# EAGLE schematic Layout Rev5 (EAGLE 9.5.1)
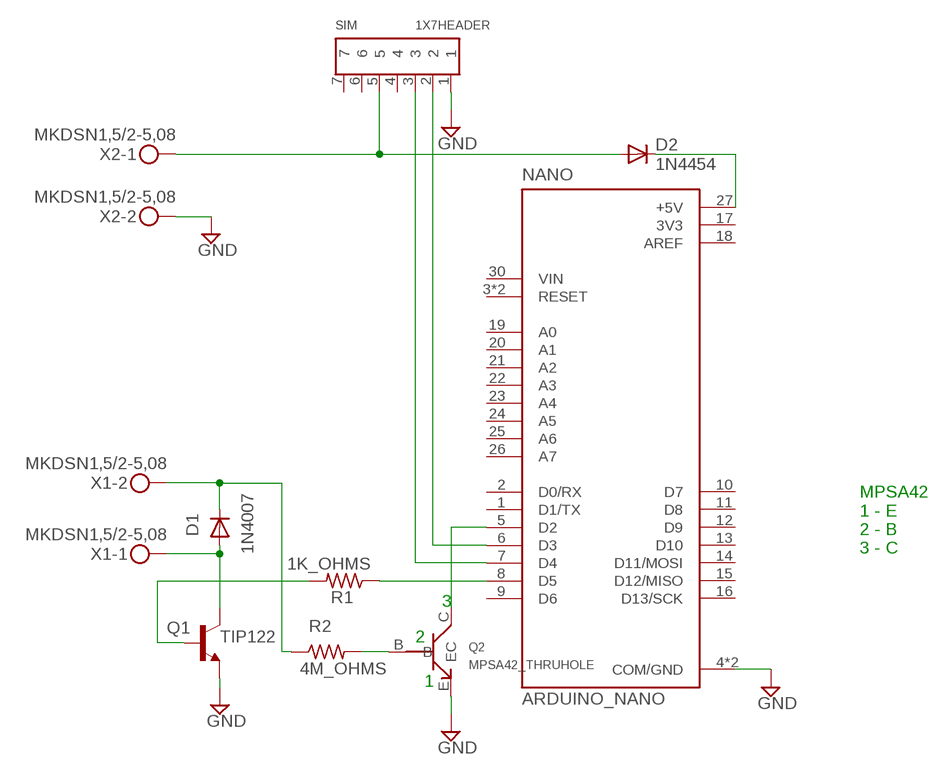
[diagram p0: schematic, sheet 1]

## Parts
D1  1N4007  1N4004  [DO41-10]
D2  1N4454  1N4004  [DO41-10]
NANO  ARDUINO_NANO  [SHIELD_ARDUINO_NANO]
Q1  TIP122  2SC1306  [TO220BV]
Q2  MPSA42_THRUHOLE  [MPSA42]
R1  1K_OHMS  R-US_0207/10  [0207/10]
R2  4M_OHMS  R-US_0207/10  [0207/10]
SIM  1X7HEADER  [1X7HEADER]
X1  MKDSN1,5/2-5,08  [MKDSN1,5/2-5,08]
X2  MKDSN1,5/2-5,08  [MKDSN1,5/2-5,08]

## Nets
+5V [power]: D2.A SIM.5 X2.1
GND: NANO.4(COM/GND) NANO.29(COM/GND) Q1.3(E) Q2.E SIM.1 X2.2
N$1: NANO.7(D4) SIM.3
N$2: NANO.6(D3) SIM.2
N$3 [power]: D1.C R2.1 X1.2
N$4: NANO.8(D5) R1.1
N$5 [power]: D1.A Q1.2(C) X1.1
N$7: Q2.B R2.2
N$10 [power]: D2.C NANO.27(+5V)
N$15: NANO.5(D2) Q2.C
N$16: Q1.1(B) R1.2
Unconnected: NANO.1(D1/TX) NANO.2(D0/RX) NANO.3(RESET) NANO.9(D6) NANO.10(D7) NANO.11(D8) NANO.12(D9) NANO.13(D10) NANO.14(D11/MOSI) NANO.15(D12/MISO) NANO.16(D13/SCK) NANO.19(A0) NANO.20(A1) NANO.21(A2) NANO.22(A3) NANO.23(A4) NANO.24(A5) NANO.25(A6) NANO.26(A7) NANO.28(RESET) NANO.30(VIN) SIM.4 SIM.6 SIM.7

## Notes on the sheet
- MPSA42
  1 - E
  2 - B
  3 - C
- 3
- 2
- 1

## Power pins joined to a net without a drawn wire
3V3: NANO.17(3V3)
AREF: NANO.18(AREF)

## Library data of the parts
D1 D2 = diode:1N4004: DIODE general purpose rectifier, 1 A
NANO = ARDUINO_NANO:ARDUINO_NANO: Arduino Nano, Through Hole; AVAILABILITY: Unavailable; DESCRIPTION: Dev.kit: Arduino; UART; ICSP, USB B mini, pin strips; MF: Arduino; MP: ARDUINO NANO; PACKAGE: None; PRICE: None
Q1 = transistor:2SC1306: NPN Transistor Final RF Power Outupt Source: 2sc1306.pdf
Q2 = MPSA42_thruhole:MPSA42_THRUHOLE
R1 R2 = rcl:R-US_: RESISTOR, American symbol; SPICEPREFIX: R
SIM = 1x7header:1X7HEADER
X1 X2 = con-phoenix-508:MKDSN1,5/2-5,08: MKDSN 1,5/ 2-5,08 Printklemme Nennstrom: 13,5 A Nennspannung: 250 V Rastermaß: 5,08 mm Polzahl: 2 Anschlussart: Schraubanschluss Montage: Löten Anschlussrichtung Leiter/Platine: 0 ° Artikelnummer: 1729128 Source: http://eshop.phoenixcontact.com .. 1729128.pdf

## Net classes
0 default: width 0.254 mm, drill 0.305 mm, clearance 0.305 mm
1 power: width 0.61 mm, drill 0.66 mm, clearance 0.305 mm
2 power1: width 3.81 mm, drill 2.54 mm, clearance 0.305 mm